# EAGLE design BuckPower (EAGLE 6.1)
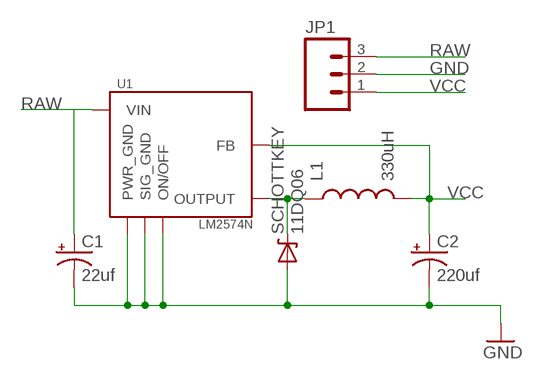
[diagram p0: schematic, sheet 1]

## Parts
C1  22uf  CAP_POLPTH1  [CPOL-RADIAL-100UF-25V]
C2  220uf  CAP_POLPTH1  [CPOL-RADIAL-100UF-25V]
JP1  M031X03_NO_SILK  [1X03_NO_SILK]
L1  330uH  INDUCTOR1206H*  [INDUCTOR-1206]
SCHOTTKEY  11DQ06  DIODE-ZENERPTH  [DIODE-ZENER]
U1  LM2574N  [8DILL]

## Nets
GND: C1.2(-) C2.2(-) JP1.2 SCHOTTKEY.P$2(A) U1.2(SIG_GND) U1.3(ON/OFF) U1.4(PWR_GND)
N$1: L1.P$1 SCHOTTKEY.P$1(C) U1.7(OUTPUT)
RAW: C1.1(+) JP1.3 U1.5(VIN)
VCC: C2.1(+) JP1.1 L1.P$2 U1.1(FB)

## Library data of the parts
C1 C2 = SparkFun:CAP_POL: Capacitor Polarized These are standard SMD and PTH capacitors. Normally 10uF, 47uF, and 100uF in electrolytic and tantalum varieties. Always verify the external diameter of the through hole cap, it varies with capacity, voltage, and manufacturer. The EIA devices should be standard.
JP1 = SparkFun:M03: Header 3 Standard 3-pin 0.1" header. Use with straight break away headers (SKU : PRT-00116), right angle break away headers (PRT-00553), swiss pins (PRT-00743), machine pins (PRT-00117), and female headers (PRT-00115). Molex polarized connector foot print use with SKU : PRT-08232 with associated crimp pins and housings.
L1 = SparkFun:INDUCTOR: Inductors Basic Inductor/Choke - 0603 and 1206. Footprints are not proven and vary greatly between part numbers.
SCHOTTKEY = SparkFun:DIODE-ZENER: Zener Diode Production Part - 8199 3.4V Zener Voltage
U1 = Dustin:LM2574N

## Board
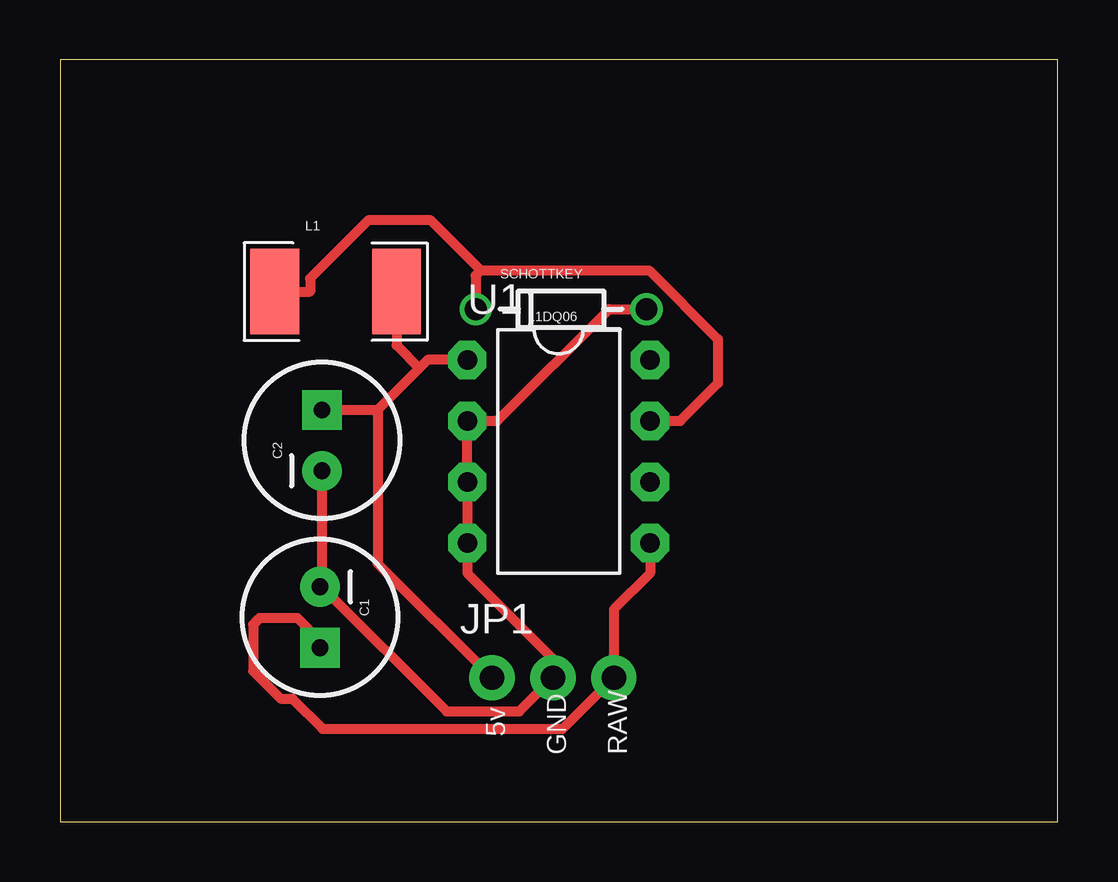
[diagram p1: board, top side]

Size 41.58 x 31.74 mm. Coordinates in mm from the lower left corner, seen from the top.
Outline: 0,0 41.58,0 41.58,31.74 0,31.74 0,0
Copper layers (1*16): Top 0.0178mm / dielectric 59mil / Bottom 0.0178mm
Design rules: minimum track width 16mil, minimum drill 35mil, track to track 11mil, track to pad 10mil, pad to pad 10mil, via to via 30mil, smd to smd 6mil, copper to edge 20mil, drill to drill 16mil, minimum pad ring 8mil, minimum via ring 8mil, stop-mask expansion 3mil, vias tented up to drill 0mil, thermal gap 10mil
tRestrict: area 13.1,24.3 to 15.3,24.6; area 25.7,18.5 to 26.9,19.9

### Footprints (pad centres in the part's own frame; a part is rotated, then mirrored left to right if it is on the bottom)
CPOL-RADIAL-100UF-25V = drill 0.7 pad 1.651 square: 1 1.27,0 | drill 0.7 pad 1.651: 2 -1.27,0
1X03_NO_SILK = drill 1.016 pad 1.88: 1 0,0; 2 2.54,0; 3 5.08,0
INDUCTOR-1206 = smd 2.032 x 3.556: P$1 -2.54,0; P$2 2.54,0
DIODE-ZENER = drill 0.9: P$1 -3.556,0; P$2 3.556,0
8DILL = drill 0.813 pad 1.6 octagon: 1 -3.81,-3.81; 2 -1.27,-3.81; 3 1.27,-3.81; 4 3.81,-3.81; 5 3.81,3.81; 6 1.27,3.81; 7 -1.27,3.81; 8 -3.81,3.81

### Placement (x,y rotation side)
C1  10.83,8.52 270 top
C2  10.92,15.89 90 top
JP1  18,6 0 top
L1  11.48,22.09 0 top
SCHOTTKEY  20.88,21.36 0 top
U1  20.78,15.43 270 top

### Tracks (layer width: path | path; a pad name or v marks a point on that pad's centre or on a via)
GND
  Top 0.406: 10.92,9.79 16.11,4.6 19.14,4.6 JP1.2 20.54,6.79 16.97,10.36 U1.4 U1.3 U1.2 18.23,16.7 22.88,21.36 SCHOTTKEY.P$2 | 10.92,9.79 C1.2 | C2.2 10.92,9.79
N$1
  Top 0.406: 17.54,22.98 17.32,22.76 SCHOTTKEY.P$1 | 17.54,22.98 24.54,22.98 27.41,20.11 27.41,18.27 25.85,16.7 U1.7 | 17.54,22.98 15.46,25.06 12.84,25.06 10.42,22.64 10.42,22.09 L1.P$1
RAW
  Top 0.406: 9.68,5.13 9.2,5.13 8.05,6.28 8.05,8.21 8.2,8.37 8.32,8.48 9.9,8.48 10.83,7.55 C1.1 | 9.68,5.13 | 9.68,5.13 10.95,3.87 20.95,3.87 JP1.3 23.08,8.85 24.59,10.36 U1.5
VCC
  Top 0.406: 14.98,18.9 13.24,17.16 | U1.1 15.32,19.24 14.98,18.9 | 14.98,18.9 14.03,19.85 L1.P$2 | 13.24,17.16 13.24,10.76 JP1.1 | 13.24,17.16 12.2,17.16 C2.1

### Text on the board
tNames: 5v | GND | RAW